# Altium project ZNT_V1.0.PrjPcb
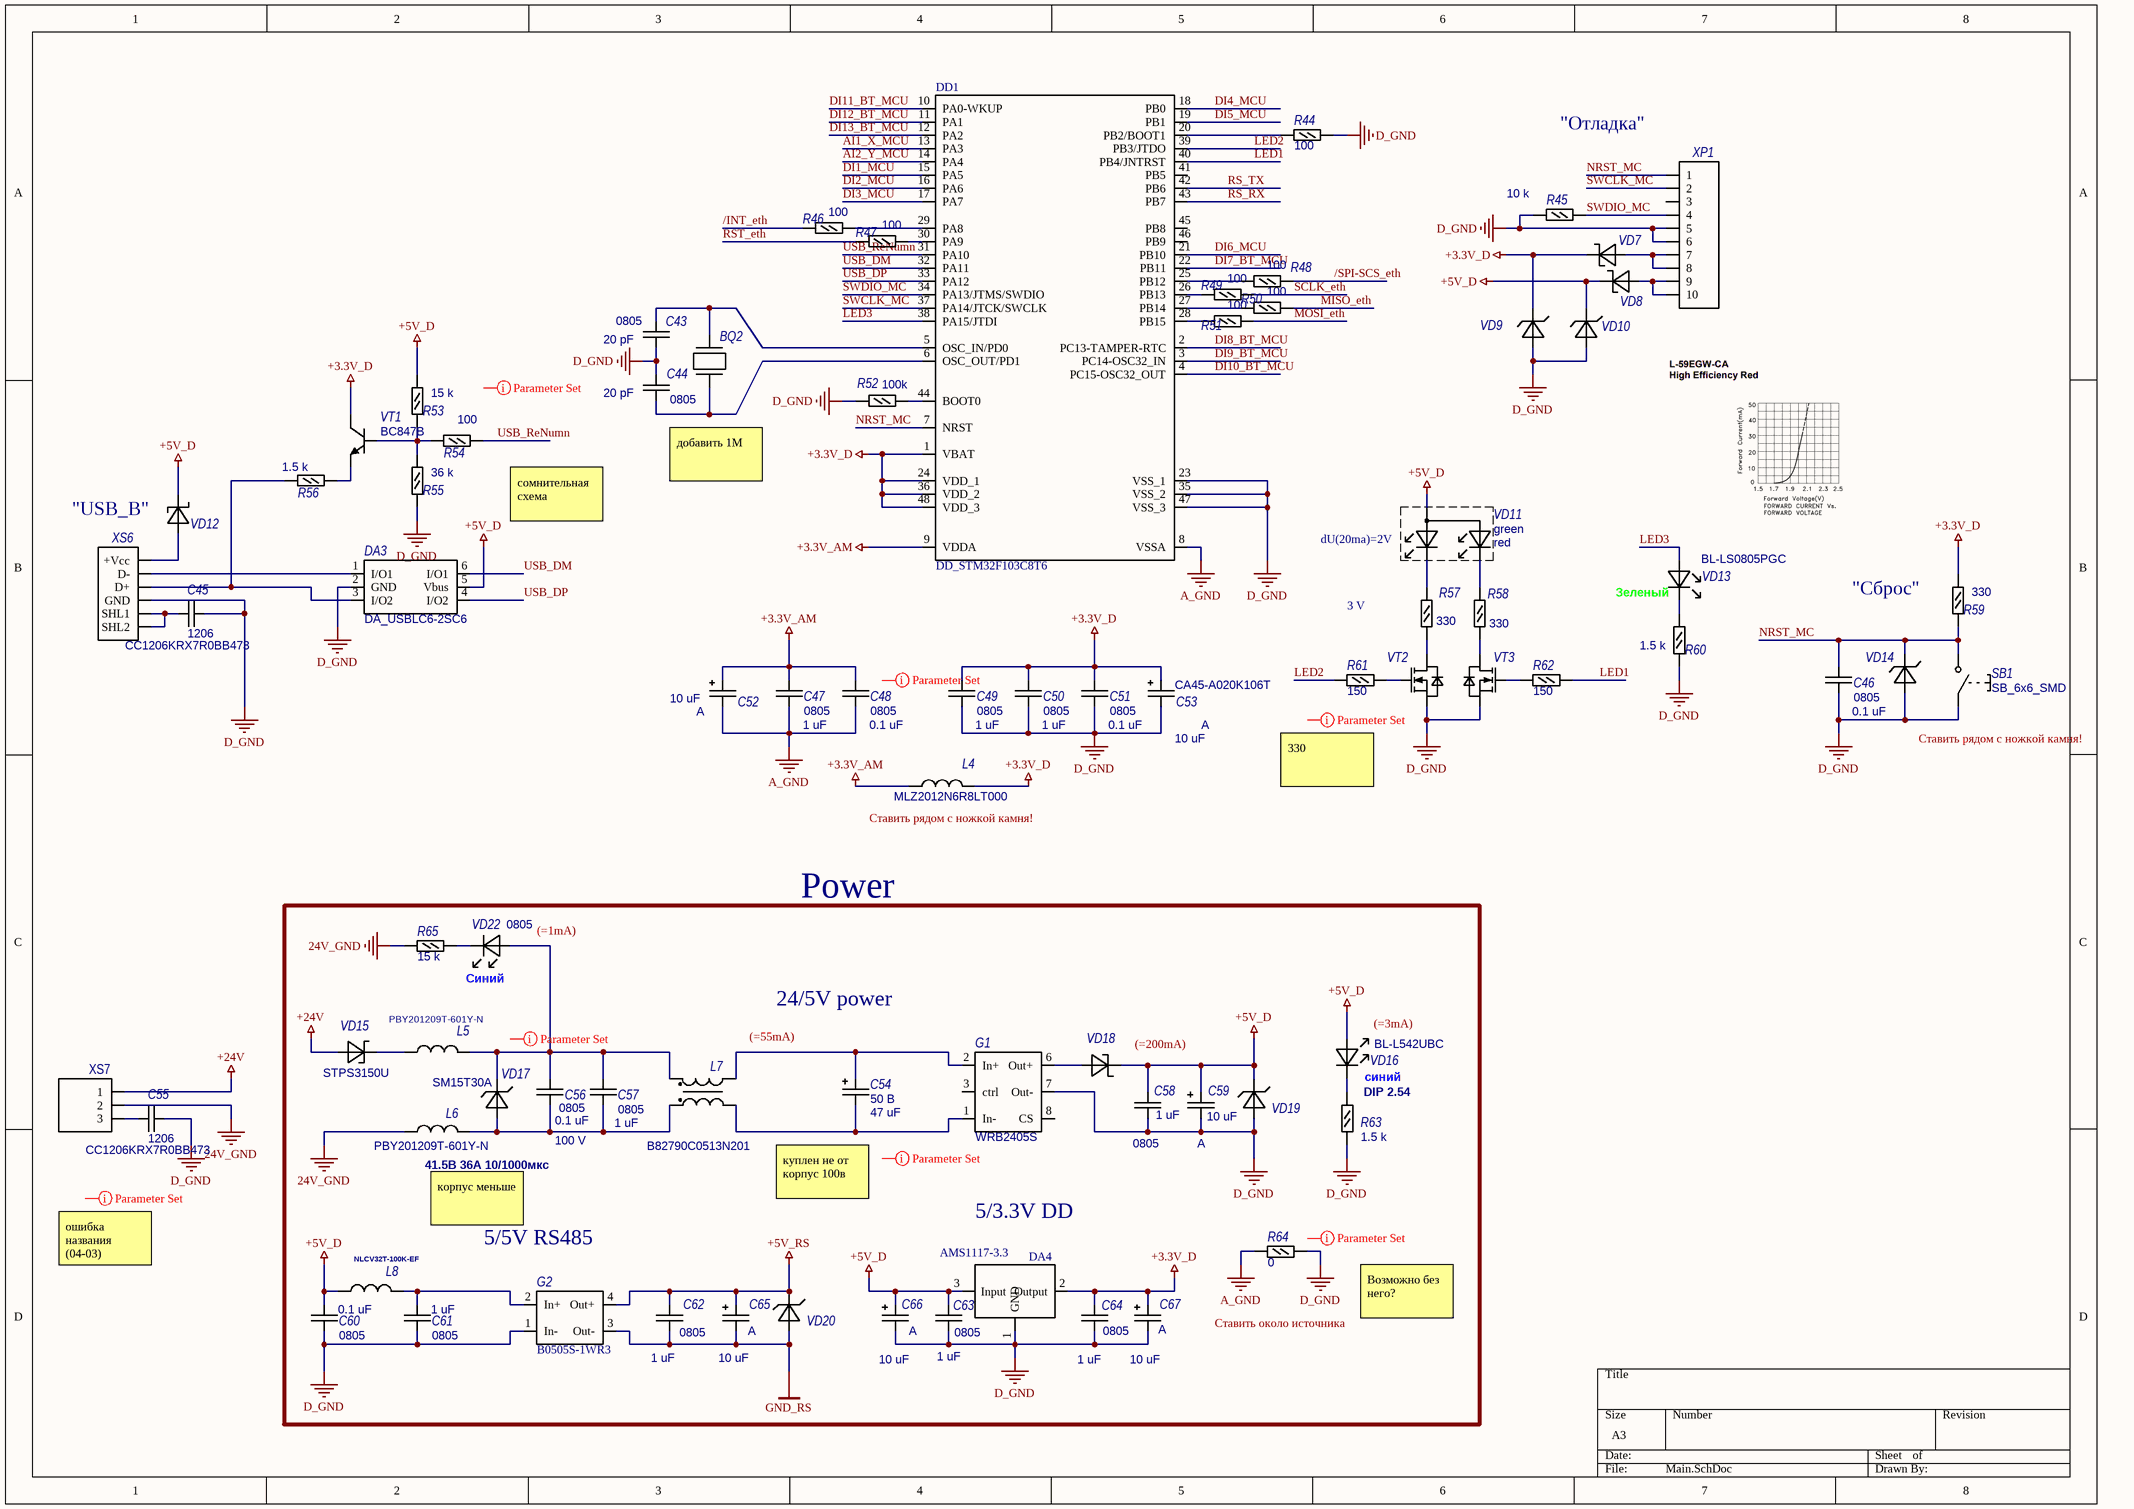
[diagram p0: Main.SchDoc]
3 sheets, 190 parts. Net scope: global (net labels, ports and power ports of the same name join across sheets).
Board file: PCB1.PcbDoc
Sheets:
  Main.SchDoc
  Eth.SchDoc
  Ai.SchDoc

## Sheet Main.SchDoc
size A3

### Parts
BQ2  (no value)  [Xtal_HC49S]
C43  0805  Номинал: 20 pF  [CAP_0805_(2x1.25x1.3)]
C44  0805  Номинал: 20 pF  [CAP_0805_(2x1.25x1.3)]
C45  1206  Наименование: CC1206KRX7R0BB473  [CAP_1206_(3.2x1.6x1.5)]
C46  0805  Номинал: 0.1 uF  [CAP_0805_(2x1.25x1.3)]
C47  0805  Номинал: 1 uF  [CAP_0805_(2x1.25x1.3)]
C48  0805  Номинал: 0.1 uF  [CAP_0805_(2x1.25x1.3)]
C49  0805  Номинал: 1 uF  [CAP_0805_(2x1.25x1.3)]
C50  0805  Номинал: 1 uF  [CAP_0805_(2x1.25x1.3)]
C51  0805  Номинал: 0.1 uF  [CAP_0805_(2x1.25x1.3)]
C52  Корпус: A  Номинал: 10 uF  [CAP_TAN_A]  (hidden comment: TAN_A)
C53  Корпус: A  Наименование: CA45-A020K106T  Номинал: 10 uF  [CAP_TAN_A]  (hidden comment: TAN_A)
C54  Напряжение: 50 В  Номинал: 47 uF  [CAP_EL_K50-35_(8x11.5)]  (hidden comment: K50-35)
C55  1206  Наименование: CC1206KRX7R0BB473  [CAP_1206_(3.2x1.6x1.5)]
C56  0805  Напряжение: 100 V  Номинал: 0.1 uF  [CAP_0805_(2x1.25x1.3)]
C57  0805  Номинал: 1 uF  [CAP_0805_(2x1.25x1.3)]
C58  0805  Номинал: 1 uF  [CAP_0805_(2x1.25x1.3)]
C59  Корпус: A  Номинал: 10 uF  [CAP_TAN_A]  (hidden comment: TAN_A)
C60  0805  Номинал: 0.1 uF  [CAP_0805_(2x1.25x1.3)]
C61  0805  Номинал: 1 uF  [CAP_0805_(2x1.25x1.3)]
C62  0805  Номинал: 1 uF  [CAP_0805_(2x1.25x1.3)]
C63  0805  Номинал: 1 uF  [CAP_0805_(2x1.25x1.3)]
C64  0805  Номинал: 1 uF  [CAP_0805_(2x1.25x1.3)]
C65  Корпус: A  Номинал: 10 uF  [CAP_TAN_A]  (hidden comment: TAN_A)
C66  Корпус: A  Номинал: 10 uF  [CAP_TAN_A]  (hidden comment: TAN_A)
C67  Корпус: A  Номинал: 10 uF  [CAP_TAN_A]  (hidden comment: TAN_A)
DA3  DA_USBLC6-2SC6  [SOT-23-6L]
DA4  AMS1117-3.3  [SOT-223_Dupl]
DD1  DD_STM32F103C8T6  [LQFP_48]
G1  WRB2405S  [WRB2405S(SIP-8) - duplicate]
G2  Наименование: B0505S-1WR3  [AM1S-Z]  (hidden comment: AM1S-Z)
L4  Наименование: MLZ2012N6R8LT000  [L_0805]  (hidden comment: PBY201209T-601Y-N)
L5  PBY201209T-601Y-N  [L_0805]
L6  PBY201209T-601Y-N  [L_0805]
L7  Наименование: B82790C0513N201  [B82790]  (hidden comment: B82790)
L8  Наименование: NLCV32T-100K-EF  [L_SRN3015]  (hidden comment: SRN3015)
R44  Номинал: 100  [RES_0805_(2x1.2x0.45)_0.125Вт]  (hidden comment: 0805)
R45  Номинал: 10 k  [RES_0805_(2x1.2x0.45)_0.125Вт]  (hidden comment: 0805)
R46  Номинал: 100  [RES_0805_(2x1.2x0.45)_0.125Вт]  (hidden comment: 0805)
R47  Номинал: 100  [RES_0805_(2x1.2x0.45)_0.125Вт]  (hidden comment: 0805)
R48  Номинал: 100  [RES_0805_(2x1.2x0.45)_0.125Вт]  (hidden comment: 0805)
R49  Номинал: 100  [RES_0805_(2x1.2x0.45)_0.125Вт]  (hidden comment: 0805)
R50  Номинал: 100  [RES_0805_(2x1.2x0.45)_0.125Вт]  (hidden comment: 0805)
R51  Номинал: 100  [RES_0805_(2x1.2x0.45)_0.125Вт]  (hidden comment: 0805)
R52  Номинал: 100k  [RES_0805_(2x1.2x0.45)_0.125Вт]  (hidden comment: 0805)
R53  Номинал: 15 k  [RES_0805_(2x1.2x0.45)_0.125Вт]  (hidden comment: 0805)
R54  Номинал: 100  [RES_0805_(2x1.2x0.45)_0.125Вт]  (hidden comment: 0805)
R55  Номинал: 36 k  [RES_0805_(2x1.2x0.45)_0.125Вт]  (hidden comment: 0805)
R56  Номинал: 1.5 k  [RES_0805_(2x1.2x0.45)_0.125Вт]  (hidden comment: 0805)
R57  Номинал: 330  [RES_0805_(2x1.2x0.45)_0.125Вт]  (hidden comment: 0805)
R58  Номинал: 330  [RES_0805_(2x1.2x0.45)_0.125Вт]  (hidden comment: 0805)
R59  Номинал: 330  [RES_0805_(2x1.2x0.45)_0.125Вт]  (hidden comment: 0805)
R60  Номинал: 1.5 k  [RES_0805_(2x1.2x0.45)_0.125Вт]  (hidden comment: 0805)
R61  Номинал: 150  [RES_0805_(2x1.2x0.45)_0.125Вт]  (hidden comment: 0805)
R62  Номинал: 150  [RES_0805_(2x1.2x0.45)_0.125Вт]  (hidden comment: 0805)
R63  Номинал: 1.5 k  [RES_0805_(2x1.2x0.45)_0.125Вт]  (hidden comment: 0805)
R64  Номинал: 0  [RES_0805_(2x1.2x0.45)_0.125Вт]  (hidden comment: 0805)
R65  Номинал: 15 k  [RES_0805_(2x1.2x0.45)_0.125Вт]  (hidden comment: 0805)
SB1  SB_6x6_SMD  [SB_6x6_SMD]
VD7  VD_SH_SMA  [VD_SMA_(Do-214AC)]  (value not drawn)
VD8  VD_SH_SMA  [VD_SMA_(Do-214AC)]  (value not drawn)
VD9  ESD  [VD_SOD523]  (value not drawn)
VD10  ESD  [VD_SOD523]  (value not drawn)
VD11  Тип: green  Примечания: red  [VD_LEDsx2]  (hidden comment: VD_Ledx2_dip)
VD12  VD_SH_SMA  [VD_SMA_(Do-214AC)]  (value not drawn)
VD13  Наименование: BL-LS0805PGC  Примечания: Зеленый  [led_0805]  (hidden comment: VD_Led_0805)
VD14  ESD  [VD_SOD523]  (value not drawn)
VD15  STPS3150U  [VD_SMB_(Do-214AA)]
VD16  Корпус: DIP 2.54  Наименование: BL-L542UBC  Примечания: синий  [VD_LED_dip]  (hidden comment: VD_Led)
VD17  SM15T30A  Номинал: 41.5В 36А 10/1000мкс  [VD_SMC_(Do-214AB)]
VD18  VD_SH_SMA  [VD_SMA_(Do-214AC)]  (value not drawn)
VD19  VD_SMA  [VD_SMA_(Do-214AC)]  (value not drawn)
VD20  VD_SMA  [VD_SMA_(Do-214AC)]  (value not drawn)
VD22  Корпус: 0805  Примечания: Синий  [led_0805]  (hidden comment: VD_Led_0805)
VT1  BC847B  [SOT-23]
VT2  VT_IRLML0040TRPBF  [SOT-23]  (value not drawn)
VT3  VT_IRLML0040TRPBF  [SOT-23]  (value not drawn)
XP1  XP_5x2_V  [XP_5x2_PIN_V]  (value not drawn)
XS6  XS_USB_B  [XS_USBB]  (value not drawn)
XS7  XS_3_pin_3.8mm  [XS_3_Pin _3.8mm]  (value not drawn)

### Blocks framed on the sheet
Power: C54 C56-C67 DA4 G1 G2 L5-L8 R63-R65 VD15-VD20 VD22

### Nets
24V_GND: L6.1 R65.1 XS7.2
+3.3V_AM: C47.2 C48.2 C52.1 DD1.9(VDDA) L4.1
+3.3V_D: C49.2 C50.2 C51.2 C53.1 C64.2 C67.1 DA4.2(Output) DD1.1(VBAT) DD1.24(VDD_1) DD1.36(VDD_2) DD1.48(VDD_3) L4.2 R59.1 VD7.2(K) VD9.2(K) VT1.3(C)
+5V_D: C58.2 C59.1 C60.2 C63.2 C66.1 DA3.5(Vbus) DA4.3(Input) L8.1 R53.2 VD8.2(K) VD10.2(K) VD11.2(A) VD12.2(K) VD16.1(A) VD18.2(K) VD19.2(K)
+5V_RS: C62.2 C65.1 G2.4(Out+) VD20.2(K)
+24V: VD15.1(A) XS7.1
A_GND: C47.1 C48.1 C52.2 DD1.8(VSSA) R64.1
D_GND: C43.1 C44.2 C45.2 C46.1 C49.1 C50.1 C51.1 C53.2 C55.2 C58.1 C59.2 C60.1 C61.1 C63.1 C64.1 C66.2 C67.2 DA3.2(GND) DA4.1(GND) DD1.23(VSS_1) DD1.35(VSS_2) DD1.47(VSS_3) G1.7(Out-) G2.1(In-) R44.1 R45.2 R52.2 R55.1 R60.1 R63.1 R64.2 SB1.1 VD9.1(A) VD10.1(A) VD14.1(A) VD19.1(A) VT2.2(S) VT3.2(S) XP1.5 XP1.6 XS6.4(GND)
GND_RS: C62.1 C65.2 G2.3(Out-) VD20.1(A)
/INT_eth: R46.2
/SPI-SCS_eth: R48.1
AI1_X_MCU: DD1.13(PA3)
AI2_Y_MCU: DD1.14(PA4)
DI1_MCU: DD1.15(PA5)
DI2_MCU: DD1.16(PA6)
DI3_MCU: DD1.17(PA7)
DI4_MCU: DD1.18(PB0)
DI5_MCU: DD1.19(PB1)
DI6_MCU: DD1.21(PB10)
DI7_BT_MCU: DD1.22(PB11)
DI8_BT_MCU: DD1.2(PC13-TAMPER-RTC)
DI9_BT_MCU: DD1.3(PC14-OSC32_IN)
DI10_BT_MCU: DD1.4(PC15-OSC32_OUT)
DI11_BT_MCU: DD1.10(PA0-WKUP)
DI12_BT_MCU: DD1.11(PA1)
DI13_BT_MCU: DD1.12(PA2)
LED1: DD1.40(PB4/JNTRST) R62.2
LED2: DD1.39(PB3/JTDO) R61.1
LED3: DD1.38(PA15/JTDI) VD13.1(A)
MISO_eth: R50.1
MOSI_eth: R51.1
NRST_MC: C46.2 DD1.7(NRST) R59.2 SB1.2 VD14.2(K) XP1.1
RS_RX: DD1.43(PB7)
RS_TX: DD1.42(PB6)
RST_eth: R47.2
SCLK_eth: R49.1
SWCLK_MC: DD1.37(PA14/JTCK/SWCLK) XP1.2
SWDIO_MC: DD1.34(PA13/JTMS/SWDIO) R45.1 XP1.4
USB_DM: DA3.6(I/O1) DD1.32(PA11)
USB_DP: DA3.4(I/O2) DD1.33(PA12)
USB_ReNumn: DD1.31(PA10) R54.1
NetBQ2_1: BQ2.1 C44.1 DD1.6(OSC_OUT/PD1)
NetBQ2_2: BQ2.2 C43.2 DD1.5(OSC_IN/PD0)
NetC45_1: C45.1 XS6.5(SHL1) XS6.6(SHL2)
NetC54_1: C54.1 G1.2(In+) L7.4
NetC54_2: C54.2 G1.1(In-) L7.3
NetC55_1: C55.1 XS7.3
NetC56_1: C56.1 C57.1 L6.2 L7.2 VD17.1(A)
NetC56_2: C56.2 C57.2 L5.2 L7.1 VD17.2(K) VD22.1(A)
NetC61_2: C61.2 G2.2(In+) L8.2
NetDA3_1: DA3.1(I/O1) XS6.2(D-)
NetDA3_3: DA3.3(I/O2) R56.2 XS6.3(D+)
NetDD1_20: DD1.20(PB2/BOOT1) R44.2
NetDD1_25: DD1.25(PB12) R48.2
NetDD1_26: DD1.26(PB13) R49.2
NetDD1_27: DD1.27(PB14) R50.2
NetDD1_28: DD1.28(PB15) R51.2
NetDD1_29: DD1.29(PA8) R46.1
NetDD1_30: DD1.30(PA9) R47.1
NetDD1_44: DD1.44(BOOT0) R52.1
NetG1_6: G1.6(Out+) VD18.1(A)
NetL5_1: L5.1 VD15.2(K)
NetR53_1: R53.1 R54.2 R55.2 VT1.1(B)
NetR56_1: R56.1 VT1.2(E)
NetR57_1: R57.1 VD11.3(K2)
NetR57_2: R57.2 VT2.3(D)
NetR58_1: R58.1 VD11.1(K1)
NetR58_2: R58.2 VT3.3(D)
NetR60_2: R60.2 VD13.2(K)
NetR61_2: R61.2 VT2.1(G)
NetR62_1: R62.1 VT3.1(G)
NetR63_2: R63.2 VD16.2(K)
NetR65_2: R65.2 VD22.2(K)
NetVD7_1: VD7.1(A) XP1.7 XP1.8
NetVD8_1: VD8.1(A) XP1.9 XP1.10
NetVD12_1: VD12.1(A) XS6.1(+Vcc)

Not connected (* = marked no-connect by the designer): DD1 41(PB5) 45(PB8) 46(PB9); G1 3(ctrl) 8(CS); XP1 3

### Notes on the sheet
- "Отладка"
- "USB_B"
- сомнительная схема
- добавить 1М
- (near VD11) dU(20ma)=2V
- 3 V
- (near R59) "Сброс"
- 330
- Ставить рядом с ножкой камня!
- (near L4) Ставить рядом с ножкой камня!
- (near VD22) (=1mA)
- (near L7) (=55mA)
- 24/5V power
- (near VD18) (=200mA)
- (near VD16) (=3mA)
- куплен не от корпус 100в
- ошибка названия (04-03)
- (near L6) корпус меньше
- (near G2) 5/5V RS485
- 5/3.3V DD
- Ставить около источника
- Возможно без него?

### Library data of the parts
BQ2 = Xtal: Корпус: HC-49S; Наименование: 8.000 МГц HC-49S; Номинал: 8Mhz; Поставщик: chipdip; Идентификатор: 8.000 МГц HC-49S
C43 C44 = C_0805: Керамика; Тип: Конденсатор; Наименование: TCC0805COG200J500BT; Аналог: GRM2165C1H200J; Корпус: 0805; Идентификатор: TCC0805COG200J500BT
C45 C55 = C_1206: Керамика; Тип: Конденсатор; Напряжение: 250 В; Номинал: 0.047 uF; Аналог: GRM31CR72E473K; Корпус: 1206; Идентификатор: CC1206KRX7R0BB473
C46 C48 C51 C60 = C_0805: Керамика; Тип: Конденсатор; Наименование: CC0805KRX7R9BB104; Аналог: GRM21BR71H104K; Корпус: 0805; Идентификатор: CC0805KRX7R9BB104
C47 C49 C50 C57 C58 C61-C64 = C_0805: Керамика; Тип: Конденсатор; Наименование: TCC0805X7R105K500FT; Аналог: GRM21BR71H105K; Корпус: 0805; Идентификатор: TCC0805X7R105K500FT
C52 C59 C65-C67 = C+_TAN_A: Capacitor; Тип: Конденсатор; Наименование: CA45-A020K106T
C53 = C+_TAN_A: Capacitor; Тип: Конденсатор
C54 = C+_K50-35_(8x11.5): Capacitor; Тип: Конденсатор; Корпус: 8x11.5; Наименование: ECAP (К50-35 мини); Поставщик: chipdip
C56 = C_0805: Керамика; Тип: Конденсатор; Наименование: TCC0805X7R104K101FT; Корпус: 0805; Идентификатор: TCC0805X7R104K101FT; Аналог: TCC0805X7R104K101FT
DA3 = DA_USBLC6-2SC6: USB ESD protector SOT23-6; Тип: ESD protector; Корпус: SOT23-6; Наименование: USBLC6-2SC6
DA4 = DA_AMS1117-3.3: 0.8A Low Dropout Voltage Regulator       SOT 223; Наименование: AMS1117-3.3
DD1 = DD_STM32F103C8T6: STM32 ARM-based 32-bit MCU with 128 Kbytes Flash, 48-pin LQFP, Industrial Temperature; Наименование: STM32F103CBT6; Аналог: APM32F103CBT6; Published: 30-May-2008; DatasheetVersion: rev6, Mar-2008; PackageVersion: Mar-2008; PackageReference: LQFP48; Publisher: Altium Limited; PackageDescription: 48-Pin Low-Profile Quad Flat Pack, 7 x 7 mm Body, 0.5 mm Pitch (LQFP48); ComponentLink1Description: Manufacturer Link; ComponentLink1URL: www.st.com/stm32; ComponentLink2Description: Datasheet; ComponentLink2URL: http://www.st.com/stonline/products/literature/ds/13587.pdf
G1 = G_WRB2405S-1WR2: DC/DC; Номинал: 1 Вт 24/5 В; Наименование: WRB2405S-1WR2
G2 = G_AM1S-Z: DC/DC
L4-L6 = L_PBY201209T-601Y-N: L; Тип: Индуктивность
  L5 L6: Наименование: PBY201209T-601Y-N
L7 = L_B82790: L; Тип: Индуктивность
L8 = L_SRN3015: L; Тип: Индуктивность
R44 R46-R51 R54 = R_0805: Resistor; Тип: Резистор; Наименование: RC0805JR-07100RL; Корпус: 0805; Идентификатор: RC0805JR-07100RL
R45 = R_0805: Resistor; Тип: Резистор; Наименование: RC0805JR-0710KL; Корпус: 0805; Идентификатор: RC0805JR-0710KL
R52 = R_0805: Resistor; Тип: Резистор; Наименование: RC0805JR-07100KL; Корпус: 0805; Идентификатор: RC0805JR-07100KL
R53 R65 = R_0805: Resistor; Тип: Резистор; Наименование: RC0805JR-0715KL; Корпус: 0805; Идентификатор: RC0805JR-0715KL
R55 = R_0805: Resistor; Тип: Резистор; Наименование: RC0805JR-0736KL; Корпус: 0805; Идентификатор: RC0805JR-0736KL
R56 R60 R63 = R_0805: Resistor; Тип: Резистор; Наименование: RC0805JR-071K5L; Корпус: 0805; Идентификатор: RC0805JR-071K5L
R57-R59 = R_0805: Resistor; Тип: Резистор; Наименование: RC0805JR-07330RL; Корпус: 0805; Идентификатор: RC0805JR-07330RL
R61 R62 = R_0805: Resistor; Тип: Резистор; Наименование: RC0805JR-07150RL; Корпус: 0805; Идентификатор: RC0805JR-07150RL
R64 = R_0805: Resistor; Тип: Резистор; Наименование: RC0805JR-070RL; Корпус: 0805; Идентификатор: RC0805JR-070RL
SB1 = SB_6x6_SMD: Корпус: 6x6; Наименование: KLS7-TS6604-4.3-180
VD7 VD8 VD12 VD18 = VD_SH_SMA: Sh_Diode; Тип: Диод Шоттки; Корпус: SMA; Наименование: 10MQ030NPBF; Напряжение: 30В; Номинал: 1А; Поставщик: chipdip
VD9 VD14 = VD_ESD: Защитный диод; Корпус: SOD523; Наименование: ESD5Z3.3T1G TVS; Напряжение: 3.3В; Тип: Диод
VD10 = VD_ESD: Защитный диод; Корпус: SOD523; Наименование: ESD5B5.0ST1G; Напряжение: 5В; Тип: Диод
VD11 = VD_Ledx2_dip: Наименование: L-59EGW-CA
VD13 = VD_Led_0805: Корпус: 0805
VD15 = VD_STPS3150U: Диод Шоттки 150В 3А [SMB]; Корпус: SMB; Тип: Диод; Наименование: STPS3150U; Напряжение: 150В; Номинал: 3А
VD16 = VD_Led: Идентификатор: BL-L2506UBC
VD17 = VD_SMCJ48A: Защитный диод 48В; Корпус: SMC; Напряжение: 30В; Тип: Диод; Наименование: SM15T30A
VD19 VD20 = VD_SMA: Diode; Тип: Диод; Корпус: SMA; Наименование: SMAJ5.0A; Напряжение: 5В
VD22 = VD_Led_0805: Наименование: BL-LS0805DNB; Идентификатор: BL-LS0805DNB
VT1 = VT_BC847B: NPN Bipolar Transistor; Напряжение: 45В; Номинал: 0.1А; Тип: NPN; Корпус: SOT-23; Наименование: BC847B
VT2 VT3 = VT_IRLML0040TRPBF: N Mosfet 3.6A; Наименование: BSS123; Корпус: SOT-23
XP1 = XP_5x2_V: Наименование: BH10; Аналог: DS1013-10SSiB1-B-0; Идентификатор: BH10
XS6 = XS_USB_B: Корпус: USB-B; Наименование: DS1099-WN0-FE
XS7 = XS_3_pin_3.8mm: Наименование: 15EDGRC-3.81-04; Примечания: 15EDGK-3.81-04

## Sheet Eth.SchDoc
size A3
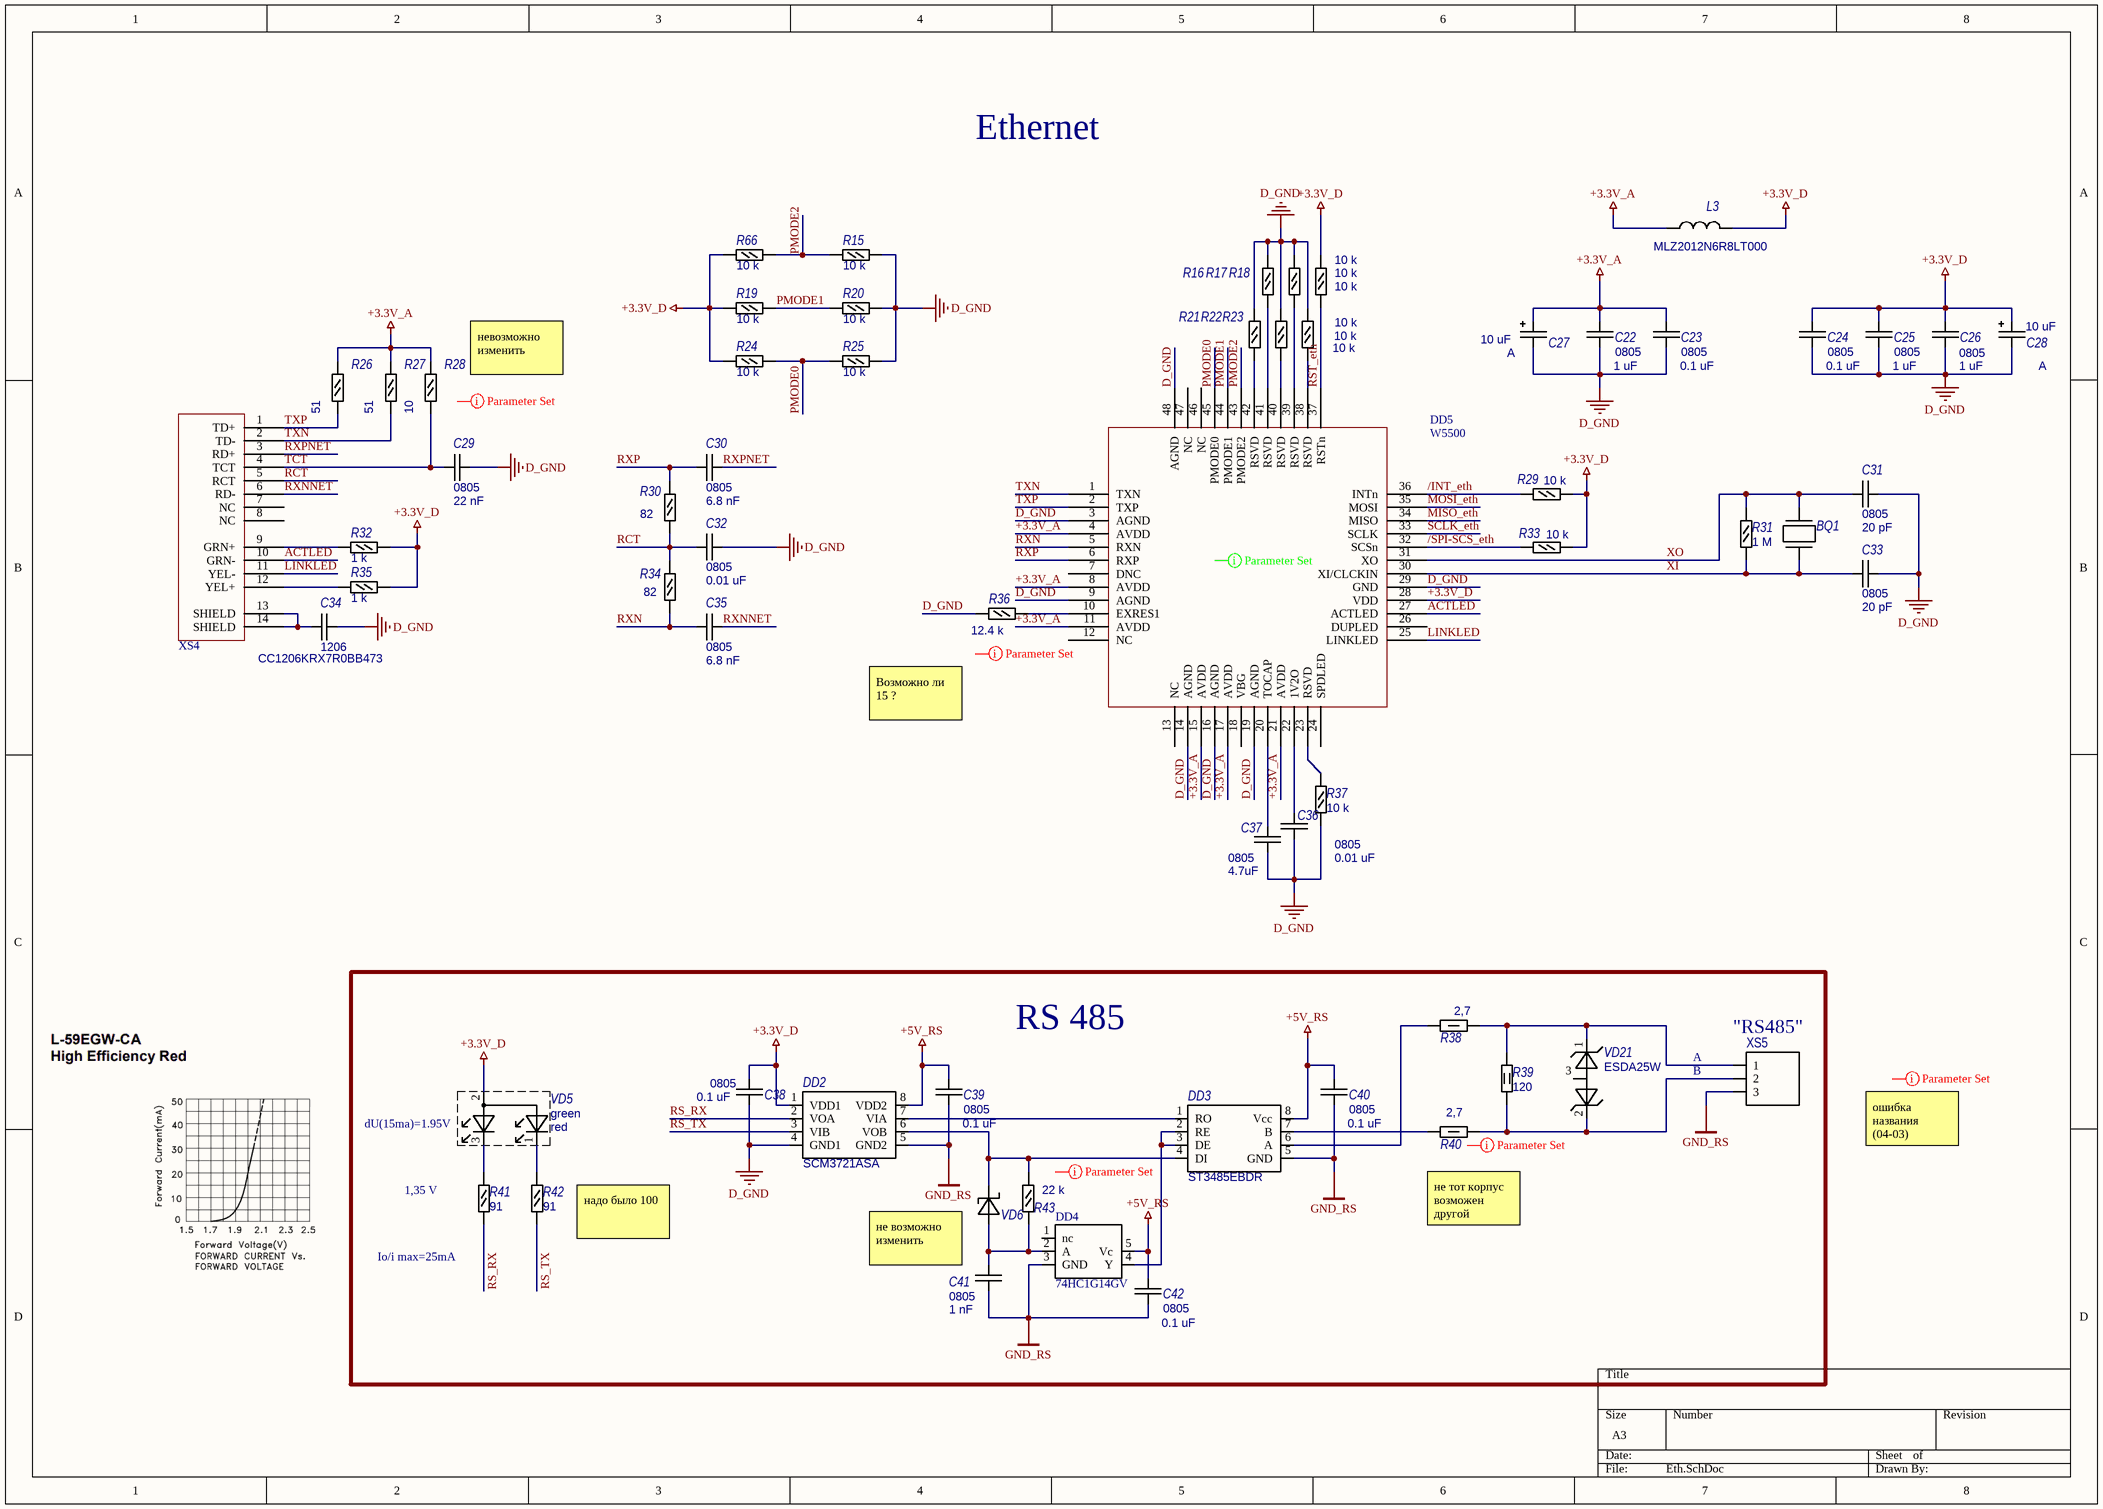
[diagram p1: Eth.SchDoc]

### Parts
BQ1  (no value)  [Xtal_HC49S]
C22  0805  Номинал: 1 uF  [CAP_0805_(2x1.25x1.3)]
C23  0805  Номинал: 0.1 uF  [CAP_0805_(2x1.25x1.3)]
C24  0805  Номинал: 0.1 uF  [CAP_0805_(2x1.25x1.3)]
C25  0805  Номинал: 1 uF  [CAP_0805_(2x1.25x1.3)]
C26  0805  Номинал: 1 uF  [CAP_0805_(2x1.25x1.3)]
C27  Корпус: A  Номинал: 10 uF  [CAP_TAN_A]  (hidden comment: TAN_A)
C28  Корпус: A  Номинал: 10 uF  [CAP_TAN_A]  (hidden comment: TAN_A)
C29  0805  Номинал: 22 nF  [CAP_0805_(2x1.25x1.3)]
C30  0805  Номинал: 6.8 nF  [CAP_0805_(2x1.25x1.3)]
C31  0805  Номинал: 20 pF  [CAP_0805_(2x1.25x1.3)]
C32  0805  Номинал: 0.01 uF  [CAP_0805_(2x1.25x1.3)]
C33  0805  Номинал: 20 pF  [CAP_0805_(2x1.25x1.3)]
C34  1206  Наименование: CC1206KRX7R0BB473  [CAP_1206_(3.2x1.6x1.5)]
C35  0805  Номинал: 6.8 nF  [CAP_0805_(2x1.25x1.3)]
C36  0805  Номинал: 0.01 uF  [CAP_0805_(2x1.25x1.3)]
C37  0805  Номинал: 4.7uF  [CAP_0805_(2x1.25x1.3)]
C38  0805  Номинал: 0.1 uF  [CAP_0805_(2x1.25x1.3)]
C39  0805  Номинал: 0.1 uF  [CAP_0805_(2x1.25x1.3)]
C40  0805  Номинал: 0.1 uF  [CAP_0805_(2x1.25x1.3)]
C41  0805  Номинал: 1 nF  [CAP_0805_(2x1.25x1.3)]
C42  0805  Номинал: 0.1 uF  [CAP_0805_(2x1.25x1.3)]
DD2  SCM3721ASA  [SOP-8]
DD3  ST3485EBDR  [SO-8_(0.15')]
DD4  74HC1G14GV  [sot-23-5]
DD5  W5500  [LQFP_48]
L3  Наименование: MLZ2012N6R8LT000  [L_0805]  (hidden comment: PBY201209T-601Y-N)
R15  Номинал: 10 k  [RES_0805_(2x1.2x0.45)_0.125Вт]  (hidden comment: 0805)
R16  Номинал: 10 k  [RES_0805_(2x1.2x0.45)_0.125Вт]  (hidden comment: 0805)
R17  Номинал: 10 k  [RES_0805_(2x1.2x0.45)_0.125Вт]  (hidden comment: 0805)
R18  Номинал: 10 k  [RES_0805_(2x1.2x0.45)_0.125Вт]  (hidden comment: 0805)
R19  Номинал: 10 k  [RES_0805_(2x1.2x0.45)_0.125Вт]  (hidden comment: 0805)
R20  Номинал: 10 k  [RES_0805_(2x1.2x0.45)_0.125Вт]  (hidden comment: 0805)
R21  Номинал: 10 k  [RES_0805_(2x1.2x0.45)_0.125Вт]  (hidden comment: 0805)
R22  Номинал: 10 k  [RES_0805_(2x1.2x0.45)_0.125Вт]  (hidden comment: 0805)
R23  Номинал: 10 k  [RES_0805_(2x1.2x0.45)_0.125Вт]  (hidden comment: 0805)
R24  Номинал: 10 k  [RES_0805_(2x1.2x0.45)_0.125Вт]  (hidden comment: 0805)
R25  Номинал: 10 k  [RES_0805_(2x1.2x0.45)_0.125Вт]  (hidden comment: 0805)
R26  Номинал: 51  [RES_0805_(2x1.2x0.45)_0.125Вт]  (hidden comment: 0805)
R27  Номинал: 51  [RES_0805_(2x1.2x0.45)_0.125Вт]  (hidden comment: 0805)
R28  Номинал: 10  [RES_0805_(2x1.2x0.45)_0.125Вт]  (hidden comment: 0805)
R29  Номинал: 10 k  [RES_0805_(2x1.2x0.45)_0.125Вт]  (hidden comment: 0805)
R30  Номинал: 82  [RES_0805_(2x1.2x0.45)_0.125Вт]  (hidden comment: 0805)
R31  Номинал: 1 M  [RES_0805_(2x1.2x0.45)_0.125Вт]  (hidden comment: 0805)
R32  Номинал: 1 k  [RES_0805_(2x1.2x0.45)_0.125Вт]  (hidden comment: 0805)
R33  Номинал: 10 k  [RES_0805_(2x1.2x0.45)_0.125Вт]  (hidden comment: 0805)
R34  Номинал: 82  [RES_0805_(2x1.2x0.45)_0.125Вт]  (hidden comment: 0805)
R35  Номинал: 1 k  [RES_0805_(2x1.2x0.45)_0.125Вт]  (hidden comment: 0805)
R36  Номинал: 12.4 k  [RES_0805_(2x1.2x0.45)_0.125Вт]  (hidden comment: 0805)
R37  Номинал: 10 k  [RES_0805_(2x1.2x0.45)_0.125Вт]  (hidden comment: 0805)
R38  Номинал: 2,7  [RES_1210_(3.2x2.5x0.55)_0.5Вт]  (hidden comment: 1210)
R39  Номинал: 120  [RES_2512_(6.3x3.1x0.6)_2Вт]  (hidden comment: 2512)
R40  Номинал: 2,7  [RES_1210_(3.2x2.5x0.55)_0.5Вт]  (hidden comment: 1210)
R41  Номинал: 91  [RES_0805_(2x1.2x0.45)_0.125Вт]  (hidden comment: 0805)
R42  Номинал: 91  [RES_0805_(2x1.2x0.45)_0.125Вт]  (hidden comment: 0805)
R43  Номинал: 22 k  [RES_0805_(2x1.2x0.45)_0.125Вт]  (hidden comment: 0805)
R66  Номинал: 10 k  [RES_0805_(2x1.2x0.45)_0.125Вт]  (hidden comment: 0805)
VD5  Тип: green  Примечания: red  [VD_LEDsx2]  (hidden comment: VD_Ledx2_dip)
VD6  VD_SH_SMA  [VD_SMA_(Do-214AC)]  (value not drawn)
VD21  ESDA25W  [SOT-323-3L]
XS4  XS_HR911105A  [XS_HR911105A(RJ45)]  (value not drawn)
XS5  XS_3_pin_3.8mm  [XS_3_Pin _3.8mm]  (value not drawn)

### Blocks framed on the sheet
RS 485: C38-C42 DD2-DD4 R38-R43 VD5 VD6 VD21 XS5

### Nets
+3.3V_A: C22.2 C23.2 C27.1 DD5.4(AVDD) DD5.8(AVDD) DD5.11(AVDD) DD5.15(AVDD) DD5.17(AVDD) DD5.21(AVDD) L3.1 R26.2 R27.2 R28.2
+3.3V_D: C24.2 C25.2 C26.2 C28.1 C38.2 DD2.1(VDD1) DD5.28(VDD) L3.2 R18.2 R19.1 R24.1 R29.2 R32.2 R33.2 R35.2 R66.1 VD5.2(A)
+5V_RS: C39.2 C40.2 C42.2 DD2.8(VDD2) DD3.8(Vcc) DD4.5(Vc)
D_GND: C22.1 C23.1 C24.1 C25.1 C26.1 C27.2 C28.2 C29.1 C31.1 C32.1 C33.1 C34.2 C36.1 C37.1 C38.1 DD2.4(GND1) DD5.3(AGND) DD5.9(AGND) DD5.14(AGND) DD5.16(AGND) DD5.19(AGND) DD5.29(GND) DD5.48(AGND) R15.2 R16.2 R17.2 R20.2 R21.2 R22.2 R23.2 R25.2 R36.1 R37.1
GND_RS: C39.1 C40.1 C41.1 C42.1 DD2.5(GND2) DD3.5(GND) DD4.3(GND) XS5.3
/INT_eth: DD5.36(INTn) R29.1
/SPI-SCS_eth: DD5.32(SCSn) R33.1
ACTLED: DD5.27(ACTLED) XS4.10(GRN-)
LINKLED: DD5.25(LINKLED) XS4.11(YEL-)
MISO_eth: DD5.34(MISO)
MOSI_eth: DD5.35(MOSI)
PMODE0: DD5.45(PMODE0) R24.2 R25.1
PMODE1: DD5.44(PMODE1) R19.2 R20.1
PMODE2: DD5.43(PMODE2) R15.1 R66.2
RCT: C32.2 R30.1 R34.2 XS4.5(RCT)
RS_RX: DD2.2(VOA) R41.1
RS_TX: DD2.3(VIB) R42.1
RST_eth: DD5.37(RSTn) R18.1
RXN: C35.2 DD5.5(RXN) R34.1
RXNNET: C35.1 XS4.6(RD-)
RXP: C30.2 DD5.6(RXP) R30.2
RXPNET: C30.1 XS4.3(RD+)
SCLK_eth: DD5.33(SCLK)
TCT: C29.2 R28.1 XS4.4(TCT)
TXN: DD5.1(TXN) R27.1 XS4.2(TD-)
TXP: DD5.2(TXP) R26.1 XS4.1(TD+)
XI: BQ1.1 C33.2 DD5.30(XI/CLCKIN) R31.1
XO: BQ1.2 C31.2 DD5.31(XO) R31.2
NetC34_1: C34.1 XS4.13(SHIELD) XS4.14(SHIELD)
NetC36_2: C36.2 DD5.22(1V2O)
NetC37_2: C37.2 DD5.20(TOCAP)
NetC41_2: C41.2 DD4.2(A) R43.2 VD6.1(A)
NetDD2_6: DD2.6(VOB) DD3.4(DI) R43.1 VD6.2(K)
NetDD2_7: DD2.7(VIA) DD3.1(RO)
NetDD3_2: DD3.2(RE) DD3.3(DE) DD4.4(Y)
NetDD3_6: DD3.6(A) R38.1
NetDD3_7: DD3.7(B) R40.1
NetDD5_10: DD5.10(EXRES1) R36.2
NetDD5_23: DD5.23(RSVD) R37.2
NetDD5_38: DD5.38(RSVD) R23.1
NetDD5_39: DD5.39(RSVD) R17.1
NetDD5_40: DD5.40(RSVD) R22.1
NetDD5_41: DD5.41(RSVD) R16.1
NetDD5_42: DD5.42(RSVD) R21.1
NetR32_1: R32.1 XS4.9(GRN+)
NetR35_1: R35.1 XS4.12(YEL+)
NetR38_2: R38.2 R39.2 VD21.1 XS5.1
NetR39_1: R39.1 R40.2 VD21.2 XS5.2
NetR41_2: R41.2 VD5.3(K2)
NetR42_2: R42.2 VD5.1(K1)

Not connected (* = marked no-connect by the designer): DD4 1(nc); DD5 7(DNC) 12(NC) 13(NC) 18(VBG) 24(SPDLED) 26(DUPLED) 46(NC) 47(NC); VD21 3; XS4 7(NC) 8(NC)

### Notes on the sheet
- Ethernet
- (near R28) невозможно изменить
- Возможно ли 15 ?
- (near XS5) "RS485"
- (near VD5) dU(15ma)=1.95V
- (near XS5) A
- (near XS5) B
- 1,35 V
- ошибка названия (04-03)
- (near R41) Io/i max=25mA
- (near R42) надо было 100
- не возможно изменить
- (near R40) не тот корпус
  возможен другой номинал

### Library data of the parts
BQ1 = Xtal: Корпус: HC-49S; Наименование: HC-49S 25 MHz; Номинал: 25Mhz; Поставщик: chipdip; Аналог: 25.000 МГц HC-49S; Идентификатор: HC-49S 25 MHz
C22 C25 C26 = C_0805: as C47 on sheet Main; Корпус: 0805; Идентификатор: TCC0805X7R105K500FT
C23 C24 C38-C40 C42 = C_0805: as C46 on sheet Main; Корпус: 0805; Идентификатор: CC0805KRX7R9BB104
C27 C28 = C+_TAN_A: as C52 on sheet Main
C29 = C_0805: Керамика; Тип: Конденсатор; Наименование: TCC0805X7R223K500DT; Аналог: GRM216R71H223K; Корпус: 0805; Идентификатор: TCC0805X7R223K500DT
C30 C35 = C_0805: Керамика; Тип: Конденсатор; Наименование: TCC0805X7R682K500DT; Аналог: GRM2195C1H682JA01D; Корпус: 0805; Идентификатор: TCC0805X7R682K500DT
C31 C33 = C_0805: as C43 on sheet Main; Корпус: 0805; Идентификатор: TCC0805COG200J500BT
C32 C36 = C_0805: Керамика; Тип: Конденсатор; Наименование: TCC0805X7R103J500DT; Parameter 1: GRM2195C1H103J; Корпус: 0805; Идентификатор: TCC0805X7R103J500DT
C34 = C_1206: as C45 on sheet Main; Корпус: 1206; Идентификатор: CC1206KRX7R0BB473
C37 = C_0805: Керамика; Тип: Конденсатор; Наименование: TCC0805X5R475K500FT; Аналог: GRM21BR61E475K; Корпус: 0805; Идентификатор: TCC0805X5R475K500FT
C41 = C_0805: Керамика; Тип: Конденсатор; Наименование: TCC0805X7R102K500DT; Аналог: GRM216R71H102K; Корпус: 0805; Идентификатор: TCC0805X7R102K500DT
DD2 = DD_SCM3721ASA: Dual-ChannelDigital Isolators; Тип: SCM3721ASA; Наименование: SCM3721ASA
DD3 = DD_ST3485EBDR: RS485/422 Приемопередатчик интерфейса; Тип: ST3485EBDR; Наименование: ST3485EBDR; Идентификатор: ST3485EBDR
DD4 = DD_74HC1G14GV: 1 канал инвертирующ триггер шмитта; Наименование: 74HC1G14GV
DD5 = DD_W5500: Поставщик: chipdip; Наименование: W5500
L3 = L_PBY201209T-601Y-N: L; Тип: Индуктивность
R15-R25 R29 R33 R37 R66 = R_0805: as R45 on sheet Main; Корпус: 0805; Идентификатор: RC0805JR-0710KL
R26 R27 = R_0805: Resistor; Тип: Резистор; Наименование: RC0805JR-0751RL; Корпус: 0805; Идентификатор: RC0805JR-0751RL
R28 = R_0805: Resistor; Тип: Резистор; Наименование: RC0805JR-0710RL; Корпус: 0805; Идентификатор: RC0805JR-0710RL
R30 R34 = R_0805: Resistor; Тип: Резистор; Наименование: RC0805JR-0782RL; Корпус: 0805; Идентификатор: RC0805JR-0782RL
R31 = R_0805: Resistor; Тип: Резистор; Наименование: RC0805JR-071ML; Корпус: 0805; Идентификатор: RC0805JR-071ML
R32 R35 = R_0805: Resistor; Тип: Резистор; Наименование: RC0805JR-071KL; Корпус: 0805; Идентификатор: RC0805JR-071KL
R36 = R_0805: Resistor; Тип: Резистор; Наименование: RC0805FR-0712K4L; Примечания: 1%; Корпус: 0805; Идентификатор: RC0805FR-0712K4L
R38 R40 = R_1210: Resistor; Тип: Резистор; Корпус: 1206; Наименование: RC1206JR-072R7L; Идентификатор: RC1206JR-072R7L
R39 = R_2512: Токочувствительные резисторы – для поверхностного монтажа 2watts 2512; Наименование: RC2512JK-07120RL; Тип: Резистор; Корпус: 2512; Идентификатор: RC2512JK-07120RL
R41 R42 = R_0805: Resistor; Тип: Резистор; Наименование: RC0805JR-0791RL; Корпус: 0805; Идентификатор: RC0805JR-0791RL
R43 = R_0805: Resistor; Тип: Резистор; Наименование: RC0805JR-0722KL; Корпус: 0805; Идентификатор: RC0805JR-0722KL
VD5 = VD_Ledx2_dip: Наименование: L-59EGW-CA
VD6 = VD_SH_SMA: as VD7 on sheet Main
VD21 = VD_ESDA25W: Защитный биполярный диод; Тип: ESDA25W; Корпус: SOT-323-3L; Наименование: ESDA25W
XS4 = XS_HR911105A: RJ45; Наименование: HR911105A
XS5 = XS_3_pin_3.8mm: as XS7 on sheet Main

## Sheet Ai.SchDoc
size A3
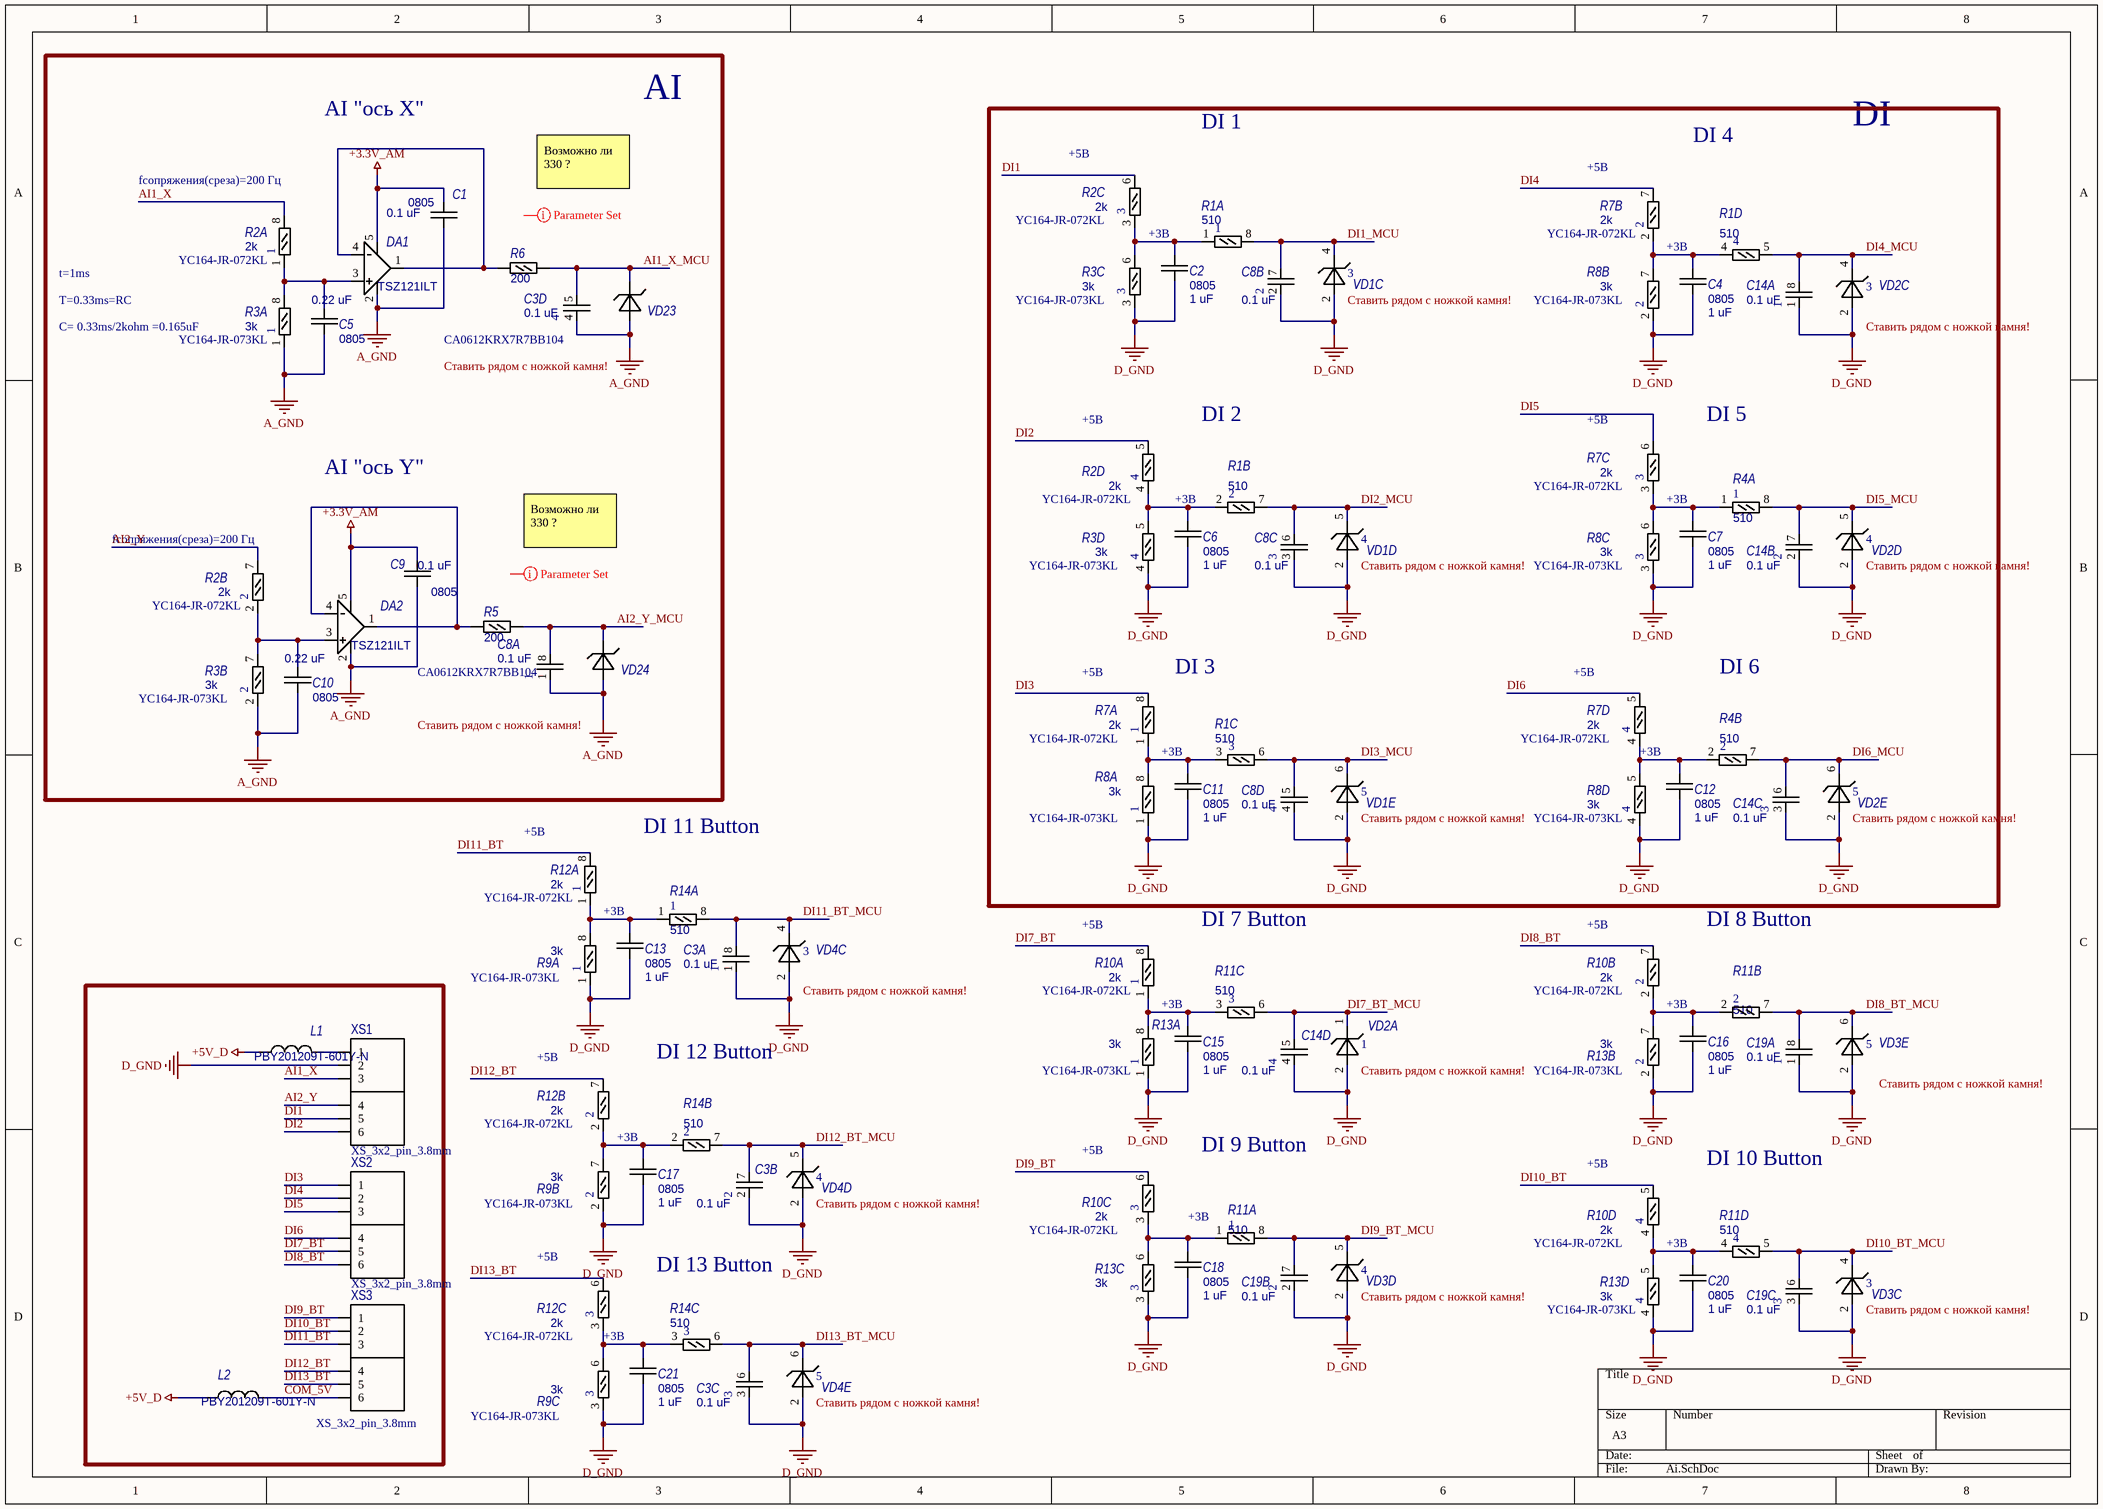
[diagram p2: Ai.SchDoc]

### Parts
C1  0805  Номинал: 0.1 uF  [CAP_0805_(2x1.25x1.3)]
C2  0805  Номинал: 1 uF  [CAP_0805_(2x1.25x1.3)]
C3  Номинал: 0.1 uF  [CA0612]  (hidden comment: Cборка 4 шт)  (parts A,B,C,D of 4)
C4  0805  Номинал: 1 uF  [CAP_0805_(2x1.25x1.3)]
C5  0805  Номинал: 0.22 uF  [CAP_0805_(2x1.25x1.3)]
C6  0805  Номинал: 1 uF  [CAP_0805_(2x1.25x1.3)]
C7  0805  Номинал: 1 uF  [CAP_0805_(2x1.25x1.3)]
C8  Номинал: 0.1 uF  Идентификатор: CA0612KRX7R7BB104  [CA0612]  (hidden comment: Cборка 4 шт)  (parts A,B,C,D of 4)
C9  0805  Номинал: 0.1 uF  [CAP_0805_(2x1.25x1.3)]
C10  0805  Номинал: 0.22 uF  [CAP_0805_(2x1.25x1.3)]
C11  0805  Номинал: 1 uF  [CAP_0805_(2x1.25x1.3)]
C12  0805  Номинал: 1 uF  [CAP_0805_(2x1.25x1.3)]
C13  0805  Номинал: 1 uF  [CAP_0805_(2x1.25x1.3)]
C14  Номинал: 0.1 uF  [CA0612]  (hidden comment: Cборка 4 шт)  (parts A,B,C,D of 4)
C15  0805  Номинал: 1 uF  [CAP_0805_(2x1.25x1.3)]
C16  0805  Номинал: 1 uF  [CAP_0805_(2x1.25x1.3)]
C17  0805  Номинал: 1 uF  [CAP_0805_(2x1.25x1.3)]
C18  0805  Номинал: 1 uF  [CAP_0805_(2x1.25x1.3)]
C19  Номинал: 0.1 uF  [CA0612]  (hidden comment: Cборка 4 шт)  (parts A,B,C of 4)
C20  0805  Номинал: 1 uF  [CAP_0805_(2x1.25x1.3)]
C21  0805  Номинал: 1 uF  [CAP_0805_(2x1.25x1.3)]
DA1  Наименование: TSZ121ILT  [SOT-23-5]  (hidden comment: Op Amp)
DA2  Наименование: TSZ121ILT  [SOT-23-5]  (hidden comment: Op Amp)
L1  PBY201209T-601Y-N  [L_0805]
L2  PBY201209T-601Y-N  [L_0805]
R1  Номинал: 510  [YC-164]  (hidden comment: сборка 4шт)  (parts A,B,C,D of 4)
R2  Номинал: 2k  Идентификатор: YC164-JR-072KL  [YC-164]  (hidden comment: сборка 4шт)  (parts A,B,C,D of 4)
R3  Номинал: 3k  Идентификатор: YC164-JR-073KL  [YC-164]  (hidden comment: сборка 4шт)  (parts A,B,C,D of 4)
R4  Номинал: 510  [YC-164]  (hidden comment: сборка 4шт)  (parts A,B of 4)
R5  Номинал: 200  [RES_0805_(2x1.2x0.45)_0.125Вт]  (hidden comment: 0805)
R6  Номинал: 200  [RES_0805_(2x1.2x0.45)_0.125Вт]  (hidden comment: 0805)
R7  Номинал: 2k  Идентификатор: YC164-JR-072KL  [YC-164]  (hidden comment: сборка 4шт)  (parts A,B,C,D of 4)
R8  Номинал: 3k  Идентификатор: YC164-JR-073KL  [YC-164]  (hidden comment: сборка 4шт)  (parts A,B,C,D of 4)
R9  Номинал: 3k  Идентификатор: YC164-JR-073KL  [YC-164]  (hidden comment: сборка 4шт)  (parts A,B,C of 4)
R10  Номинал: 2k  Идентификатор: YC164-JR-072KL  [YC-164]  (hidden comment: сборка 4шт)  (parts A,B,C,D of 4)
R11  Номинал: 510  [YC-164]  (hidden comment: сборка 4шт)  (parts A,B,C,D of 4)
R12  Номинал: 2k  Идентификатор: YC164-JR-072KL  [YC-164]  (hidden comment: сборка 4шт)  (parts A,B,C of 4)
R13  Номинал: 3k  Идентификатор: YC164-JR-073KL  [YC-164]  (hidden comment: сборка 4шт)  (parts A,B,C,D of 4)
R14  Номинал: 510  [YC-164]  (hidden comment: сборка 4шт)  (parts A,B,C of 4)
VD1  сборка 5шт  [SOT-363]  (value not drawn)  (parts C,D,E of 5)
VD2  сборка 5шт  [SOT-363]  (value not drawn)  (parts A,C,D,E of 5)
VD3  сборка 5шт  [SOT-363]  (value not drawn)  (parts C,D,E of 5)
VD4  сборка 5шт  [SOT-363]  (value not drawn)  (parts C,D,E of 5)
VD23  ESD  [VD_SOD523]  (value not drawn)
VD24  ESD  [VD_SOD523]  (value not drawn)
XS1  XS_3x2_pin_3.8mm  [XS_KLS_3x2_Pin _3.8mm]
XS2  XS_3x2_pin_3.8mm  [XS_KLS_3x2_Pin _3.8mm]
XS3  XS_3x2_pin_3.8mm  [XS_KLS_3x2_Pin _3.8mm]

### Blocks framed on the sheet
AI: C1 C3 C5 C8-C10 DA1 DA2 R2 R3 R5 R6 VD23 VD24
DI: C2 C4 C6-C8 C11 C12 C14 R1-R4 R7 R8 VD1 VD2

### Nets
+3.3V_AM: C1.2 C9.2 DA1.5(Vdd) DA2.5(Vdd)
+5V_D: L1.1 L2.1
A_GND: C1.1 C3.4 C5.1 C8.1 C9.1 C10.1 DA1.2(Vss) DA2.2(Vss) R3.1 R3.2 VD23.1(A) VD24.1(A)
D_GND: C2.1 C3.1 C3.2 C3.3 C4.1 C6.1 C7.1 C8.2 C8.3 C8.4 C11.1 C12.1 C13.1 C14.1 C14.2 C14.3 C14.4 C15.1 C16.1 C17.1 C18.1 C19.1 C19.2 C19.3 C20.1 C21.1 R3.3 R3.4 R8.1 R8.2 R8.3 R8.4 R9.1 R9.2 R9.3 R13.1 R13.2 R13.3 R13.4 VD1.2(A) VD2.2(A) VD3.2(A) VD4.2(A) XS1.2
AI1_X: R2.8 XS1.3
AI1_X_MCU: C3.5 R6.1 VD23.2(K)
AI2_Y: R2.7 XS1.4
AI2_Y_MCU: C8.8 R5.1 VD24.2(K)
COM_5V: L2.2 XS3.6
DI1: R2.6 XS1.5
DI1_MCU: C8.7 R1.8 VD1.4(K)
DI2: R2.5 XS1.6
DI2_MCU: C8.6 R1.7 VD1.5(K)
DI3: R7.8 XS2.1
DI3_MCU: C8.5 R1.6 VD1.6(K)
DI4: R7.7 XS2.2
DI4_MCU: C14.8 R1.5 VD2.4(K)
DI5: R7.6 XS2.3
DI5_MCU: C14.7 R4.8 VD2.5(K)
DI6: R7.5 XS2.4
DI6_MCU: C14.6 R4.7 VD2.6(K)
DI7_BT: R10.8 XS2.5
DI7_BT_MCU: C14.5 R11.6 VD2.1(K)
DI8_BT: R10.7 XS2.6
DI8_BT_MCU: C19.8 R11.7 VD3.6(K)
DI9_BT: R10.6 XS3.1
DI9_BT_MCU: C19.7 R11.8 VD3.5(K)
DI10_BT: R10.5 XS3.2
DI10_BT_MCU: C19.6 R11.5 VD3.4(K)
DI11_BT: R12.8 XS3.3
DI11_BT_MCU: C3.8 R14.8 VD4.4(K)
DI12_BT: R12.7 XS3.4
DI12_BT_MCU: C3.7 R14.7 VD4.5(K)
DI13_BT: R12.6 XS3.5
DI13_BT_MCU: C3.6 R14.6 VD4.6(K)
NetC2_2: C2.2 R1.1 R2.3 R3.6
NetC4_2: C4.2 R1.4 R7.2 R8.7
NetC5_2: C5.2 DA1.3(VinA+) R2.1 R3.8
NetC6_2: C6.2 R1.2 R2.4 R3.5
NetC7_2: C7.2 R4.1 R7.3 R8.6
NetC10_2: C10.2 DA2.3(VinA+) R2.2 R3.7
NetC11_2: C11.2 R1.3 R7.1 R8.8
NetC12_2: C12.2 R4.2 R7.4 R8.5
NetC13_2: C13.2 R9.8 R12.1 R14.1
NetC15_2: C15.2 R10.1 R11.3 R13.8
NetC16_2: C16.2 R10.2 R11.2 R13.7
NetC17_2: C17.2 R9.7 R12.2 R14.2
NetC18_2: C18.2 R10.3 R11.1 R13.6
NetC20_2: C20.2 R10.4 R11.4 R13.5
NetC21_2: C21.2 R9.6 R12.3 R14.3
NetDA1_1: DA1.1(VoutA) DA1.4(VinA-) R6.2
NetDA2_1: DA2.1(VoutA) DA2.4(VinA-) R5.2
NetL1_2: L1.2 XS1.1

### Notes on the sheet
- AI "ось X"
- +5В
- DI 1
- DI 4
- (near R2) fсопряжения(среза)=200 Гц
- Возможно ли 330 ?
- +3В
- t=1ms
- T=0.33ms=RC
- (near VD1) Ставить рядом с ножкой камня!
- C= 0.33ms/2kohm =0.165uF
- Ставить рядом с ножкой камня!
- (near VD2) Ставить рядом с ножкой камня!
- DI 2
- DI 5
- AI "ось Y"
- (near R7) DI 3
- DI 6
- (near R7) +3В
- DI 11 Button
- DI 7 Button
- DI 8 Button
- (near VD4) Ставить рядом с ножкой камня!
- DI 12 Button
- (near VD3) Ставить рядом с ножкой камня!
- DI 9 Button
- DI 10 Button
- DI 13 Button
- (near R12) +3В

### Library data of the parts
C1 C9 = C_0805: as C46 on sheet Main; Корпус: 0805; Идентификатор: CC0805KRX7R9BB104
C2 C4 C6 C7 C11-C13 C15-C18 C20 C21 = C_0805: as C47 on sheet Main; Корпус: 0805; Идентификатор: TCC0805X7R105K500FT
C3 C14 C19 = C_CA0612KRX7R7BB: Capacitor 4; Тип: Конденсатор; Наименование: CA0612KRX7R7BB104; Корпус: SMD 0612; Идентификатор: CA0612KRX7R7BB104
C5 C10 = C_0805: Керамика; Тип: Конденсатор; Наименование: TCC0805X7R224K500DT; Аналог: GRM21BR71H224K; Корпус: 0805; Идентификатор: TCC0805X7R224K500DT
C8 = C_CA0612KRX7R7BB: Capacitor 4; Тип: Конденсатор; Корпус: SMD 0612; Наименование: CA0612KRX7R7BB104
DA1 DA2 = DA_TSZ121ILT: Rail to Rail Op Amp; Тип: Операционный усилитель; Корпус: SOT23-5; Примечания: Rail to Rail; Идентификатор: TSZ121ILT
L1 L2 = L_PBY201209T-601Y-N: L; Тип: Индуктивность; Наименование: PBY201209T-601Y-N
R1 R4 R11 R14 = R_YC164-JR-07: Resistor 4; Тип: Резистор; Корпус: 0805; Наименование: YC164-JR-07510RL; Идентификатор: YC164-JR-07510RL
R2 R3 R7-R10 R12 R13 = R_YC164-JR-07: Resistor 4; Тип: Резистор; Корпус: 0805
  R2 R7 R10 R12: Наименование: YC164-JR-072KL
  R3 R8 R9 R13: Наименование: YC164-JR-073KL
R5 R6 = R_0805: Resistor; Тип: Резистор; Наименование: RC0805JR-07200RL; Корпус: 0805; Идентификатор: RC0805JR-07200RL
VD1-VD4 = VD_PESD3V3L5UY: Защитный диод; Корпус: SMC; Напряжение: 3.3V; Тип: Диод; Наименование: PESD3V3L5UY; Идентификатор: PESD3V3L5UY
VD23 VD24 = VD_ESD: as VD9 on sheet Main; Тип: Диод
XS1-XS3 = XS_3x2_pin_3.8mm: Наименование: DG381A-3.81- 06P; Примечания: DG381A-3.81- 06P

## Nets that join several sheets
+3.3V_AM: Main (5 pins), Ai (C1.2 C9.2 DA1.5 DA2.5)
+3.3V_D: Main (16 pins), Eth (17 pins)
+5V_D: Main (16 pins), Ai (L1.1 L2.1)
+5V_RS: Main (C62.2 C65.1 G2.4 VD20.2), Eth (6 pins)
A_GND: Main (5 pins), Ai (12 pins)
D_GND: Main (41 pins), Eth (33 pins), Ai (44 pins)
GND_RS: Main (C62.1 C65.2 G2.3 VD20.1), Eth (8 pins)
/INT_eth: Main (R46.2), Eth (DD5.36 R29.1)
/SPI-SCS_eth: Main (R48.1), Eth (DD5.32 R33.1)
AI1_X_MCU: Main (DD1.13), Ai (C3.5 R6.1 VD23.2)
AI2_Y_MCU: Main (DD1.14), Ai (C8.8 R5.1 VD24.2)
DI1_MCU: Main (DD1.15), Ai (C8.7 R1.8 VD1.4)
DI2_MCU: Main (DD1.16), Ai (C8.6 R1.7 VD1.5)
DI3_MCU: Main (DD1.17), Ai (C8.5 R1.6 VD1.6)
DI4_MCU: Main (DD1.18), Ai (C14.8 R1.5 VD2.4)
DI5_MCU: Main (DD1.19), Ai (C14.7 R4.8 VD2.5)
DI6_MCU: Main (DD1.21), Ai (C14.6 R4.7 VD2.6)
DI7_BT_MCU: Main (DD1.22), Ai (C14.5 R11.6 VD2.1)
DI8_BT_MCU: Main (DD1.2), Ai (C19.8 R11.7 VD3.6)
DI9_BT_MCU: Main (DD1.3), Ai (C19.7 R11.8 VD3.5)
DI10_BT_MCU: Main (DD1.4), Ai (C19.6 R11.5 VD3.4)
DI11_BT_MCU: Main (DD1.10), Ai (C3.8 R14.8 VD4.4)
DI12_BT_MCU: Main (DD1.11), Ai (C3.7 R14.7 VD4.5)
DI13_BT_MCU: Main (DD1.12), Ai (C3.6 R14.6 VD4.6)
MISO_eth: Main (R50.1), Eth (DD5.34)
MOSI_eth: Main (R51.1), Eth (DD5.35)
RS_RX: Main (DD1.43), Eth (DD2.2 R41.1)
RS_TX: Main (DD1.42), Eth (DD2.3 R42.1)
RST_eth: Main (R47.2), Eth (DD5.37 R18.1)
SCLK_eth: Main (R49.1), Eth (DD5.33)